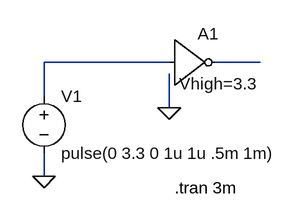
[diagram p0: schematic Not.asc]
Not.asc, the LTspice schematic file:
Version 4
SHEET 1 880 680
WIRE 160 256 160 304
WIRE -16 400 -16 368
WIRE -16 288 -16 240
WIRE -16 240 160 240
WIRE 224 240 288 240
FLAG 160 304 0
FLAG -16 400 0
SYMBOL inv 160 176 R0
WINDOW 39 14 94 Left 0
SYMATTR InstName A1
SYMATTR SpiceLine Vhigh=3.3
SYMBOL voltage -16 272 R0
SYMATTR InstName V1
SYMATTR Value pulse(0 3.3 0 1u 1u .5m 1m)
TEXT 168 416 Left 0 !.tran 3m

The netlist it stands for:
* Not.asc
A1 N001 0 0 0 0 N002 0 0 BUF Vhigh=3.3
V1 N001 0 pulse(0 3.3 0 1u 1u .5m 1m)
.tran 3m
.backanno
.end